# EasyEDA Pro project ProPrj_HydroNodeStation01_2026-04-23.epro, board PCB2
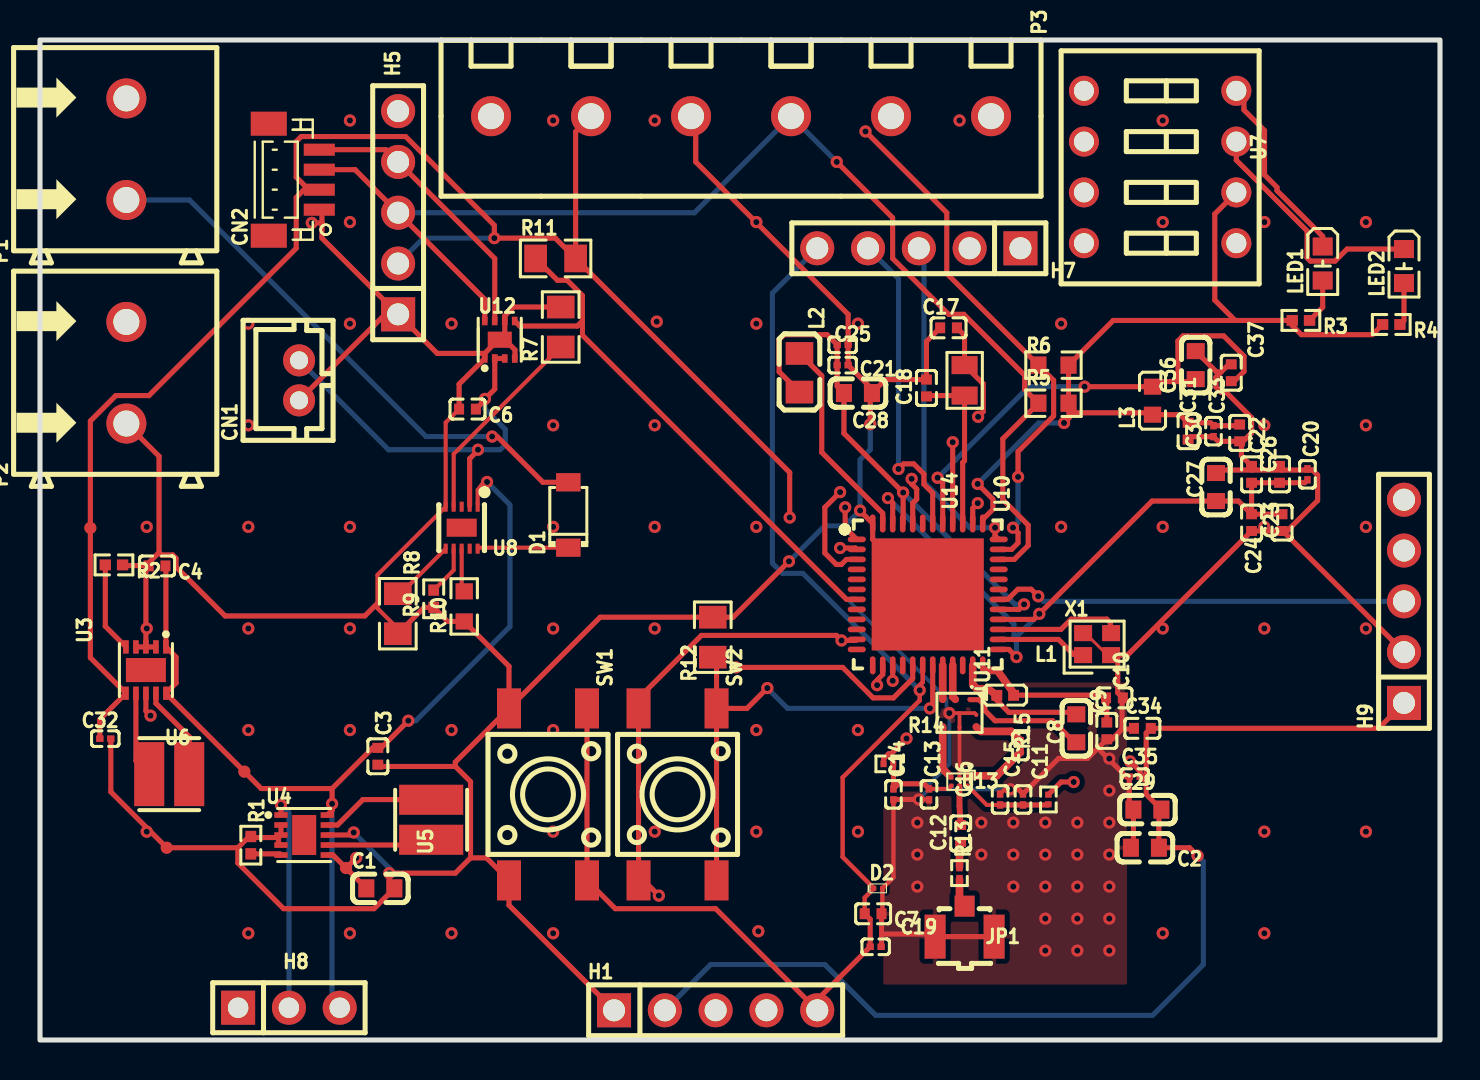
[diagram p2: board, top side]
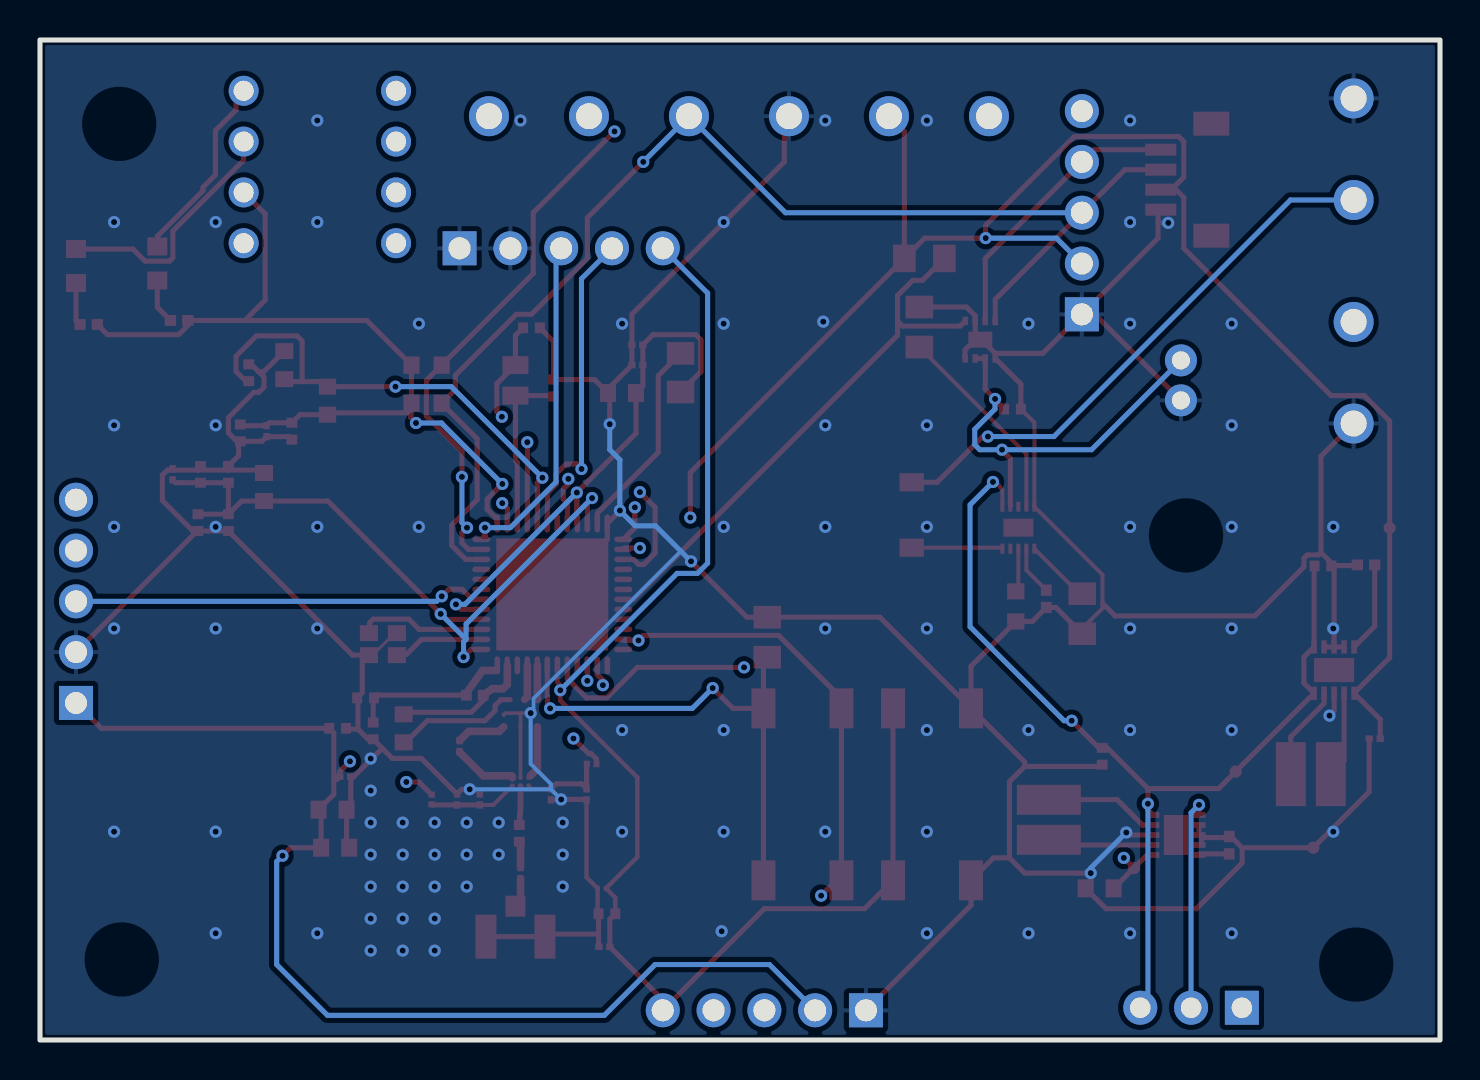
[diagram p3: board, bottom side, seen from below]

Outline 70 x 50 mm; copper layers: Top Layer, Inner1, Inner2, Bottom Layer. Coordinates in mm from the lower left corner of the outline.
Outline path: rectangle 0,50 70,0
Stack: Top Layer 0.035mm Outer layer thickness 1oz / Dielectric1 0.2104mm 7628 RC49% 8.6mil er 4.5 / Inner1 0.035mm Inner layer thickness / Dielectric2 1.065mm 1.1mm H/HOZ Copper / Inner2 0.035mm Inner layer thickness / Dielectric3 0.2104mm 7628 RC49% 8.6mil er 4.5 / Bottom Layer 0.035mm Outer layer thickness 1oz

## Design rules (mm)
template: JLCPCB Capability(Two Layers Board)
spacing copperThickness1oz (default): track to track 0.102, other pairs 0.152 to 0.3
spacing copperThickness2oz: track to track 0.203, other pairs 0.152 to 0.3
track width copperThickness1oz (default): min 0.127, default 0.254, max 2.54
track width copperThickness2oz: min 0.203, default 0.254, max 2.54
differential pair differentialPair (default): width min 0.127, default 0.254, max 2.54; gap min 0.152, default 0.152
via viaSize (default): diameter min 0.5, default 0.61, max 10; hole min 0.3, default 0.305, max 6.3
net GND uses copperThickness2oz
net +5V uses copperThickness2oz
net VCC uses copperThickness2oz
net LIPOPLUS uses copperThickness2oz
net SOLARPLUS uses copperThickness2oz

## Placement (name value [footprint] x y rotation side)
C1  22uF  [C0603]  17.02 7.58 0 top
C2  22uF  [C0603]  55.25 9.61 180 top
C3  10uF  [C0402]  16.89 14.19 270 top
C4  10uF  [C0402]  5.85 23.7 180 top
C6  100nF  [C0402]  21.38 31.55 180 top
C7  100nF  [C0402]  41.66 6.31 180 top
C8  100pF  [C0603]  51.82 15.58 90 top
C9  68pF  [C0402]  53.34 15.46 90 top
C10  47nF  [C0402]  53.72 17.11 180 top
C11  68pF  [C0201]  49.02 14.69 90 top
C12  68pF  [C0402]  46.03 10.33 90 top
C13  100nF  [C0201]  44.45 12.28 270 top
C14  1nF  [C0201]  42.67 12.28 270 top
C15  100nF  [C0201]  49.15 12.03 270 top
C16  1nF  [C0201]  48.01 12.03 270 top
C17  6.8pF  [C0402]  45.43 35.61 180 top
C18  6.8pF  [C0402]  44.32 32.6 90 top
C19  100nF  [C0201]  41.78 4.66 0 top
C20  33pF  [C0201]  63.37 28.28 270 top
C21  33pF  [C0201]  40.13 33.74 180 top
C22  100nF  [C0402]  60.58 28.28 270 top
C23  100nF  [C0402]  62.1 25.87 90 top
C24  100nF  [C0402]  60.58 25.87 90 top
C25  33pF  [C0201]  40.13 34.76 0 top
C26  100nF  [C0402]  61.98 28.28 90 top
C27  4.7uF  [C0603]  58.8 27.65 90 top
C28  470nF  [C0603]  40.9 32.35 0 top
C29  4.7uF  [C0603]  55.37 11.52 0 top
C30  100nF  [C0402]  57.4 30.44 270 top
C31  100nF  [C0402]  59.98 30.35 270 top
C32  100nF  [C0201]  3.26 15.07 0 top
C33  100nF  [C0201]  58.67 30.44 270 top
C34  100nF  [C0402]  55.12 15.58 0 top
C35  100nF  [C0201]  54.74 13.17 0 top
C36  4.7uF  [C0603]  57.79 33.74 90 top
C37  100nF  [C0402]  59.56 33.36 90 top
CN1  B2B-PH-K-S(LF)(SN)  [CONN-TH_B2B-PH-K-S]  12.95 32.98 90 top
CN2  BM04B-SRSS-TB(LF)(SN)  [CONN-SMD_BM04B-SRSS-TB]  12.7 43.02 90 top
D1  MBRX120LF-TP  [SOD-123_L2.7-W1.6-LS3.7-RD]  26.42 26.25 90 top
D2  ESDALC6V1-1U2  [DFN0603-D_L0.6-W0.3-P0.34-RD]  41.91 7.58 0 top
H1  PZ254V-11-05P  [HDR-TH_5P-P2.54-V-M]  33.78 1.49 0 top
H5  PZ254V-11-05P  [HDR-TH_5P-P2.54-V-M]  17.91 41.36 90 top
H7  PZ254V-11-05P  [HDR-TH_5P-P2.54-V-M]  43.94 39.59 180 top
H8  PZ254V-11-03P  [HDR-TH_3P-P2.54-V-M_PZ254V-11-03P]  12.45 1.61 0 top
H9  PZ254V-11-05P  [HDR-TH_5P-P2.54-V-M]  68.2 21.93 90 top
JP1  6GHz  [RF-SMD_FRF05002-JSS103M]  46.23 5.93 180 top
L1  47nH  [L0402]  48.26 17.23 180 top
L2  15uH  [L0805]  37.97 33.36 270 top
L3  FCM1608KF-601T03  [L0603]  55.63 31.97 90 top
LED1  YLED0603R  [LED0603-FD]  64.14 38.82 90 top
LED2  YLED0603R  [LED0603-FD]  68.2 38.7 90 top
NOREF  -  [Pad_e306342]  10.22 13.42 0 top
NOREF#2  -  [Pad_e306341]  6.34 9.61 0 top
NOREF#3  -  [Pad_e306354]  15.3 8.6 0 top
NOREF#4  -  [Pad_e306348]  2.52 25.6 0 top
P1  WJ500V-5.08-2P  [CONN-TH_2P-P5.00_WJ500V-5.08-2P]  4.32 44.54 90 top
P2  WJ500V-5.08-2P  [CONN-TH_2P-P5.00_WJ500V-5.08-2P]  4.32 33.36 90 top
P3  WJ126V-5.0-6P  [CONN-TH_6P-P5.00_WJ126V-5.0-6P]  35.05 46.19 270 top
R1  36.5kΩ  [R0402]  10.54 9.74 270 top
R2  16.2kΩ  [R0402]  3.7 23.76 180 top
R3  1kΩ  [R0402]  63.04 35.98 180 top
R4  1kΩ  [R0402]  67.56 35.78 180 top
R5  4.7kΩ  [R0603]  50.67 31.84 0 top
R6  4.7kΩ  [R0603]  50.67 33.74 0 top
R7  10kΩ  [R0805]  26.04 35.65 90 top
R8  10kΩ  [R0805]  17.89 21.31 270 top
R9  12kΩ  [R0402]  19.69 22.06 90 top
R10  300Ω  [R0603]  21.21 21.68 90 top
R11  10kΩ  [R0805]  25.78 39.08 0 top
R12  10kΩ  [R0805]  33.64 20.14 90 top
R13  0Ω  [R0201]  45.97 8.34 270 top
R14  100Ω  [R0201]  42.42 13.81 180 top
R15  100Ω  [R0201]  50.42 12.03 270 top
SW1  TS-1095PS-A1B2-C3D2  [KEY-SMD_4P-L6.0-W6.0-P3.90-LS9.0]  25.4 12.28 270 top
SW2  TS-1095PS-A1B2-C3D2  [KEY-SMD_4P-L6.0-W6.0-P3.90-LS9.0]  31.88 12.28 270 top
U3  TPS63900DSKR  [WSON-10_L2.5-W2.5-W0.50-TL-EP]  5.3 18.5 270 top
U4  TPS63900DSKR  [WSON-10_L2.5-W2.5-W0.50-TL-EP]  13.21 10.25 0 top
U5  2.2uH  [IND-SMD_L3.0-W3.0_LVF303012-4R7M-N]  19.56 11.01 90 top
U6  2.2uH  [IND-SMD_L3.0-W3.0_LVF303012-4R7M-N]  6.46 13.29 0 top
U7  SMQS-04R-TP  [SW-TH_8P-P2.54_SMQS-04R-TP]  56.01 43.65 270 top
U8  BQ25185DLHR  [WSON-10_L2.2-W2.0-P0.40-BL-EP_TI_DLH0010A]  21.08 25.62 180 top
U10  STM32WLE5CCU6  [UFQFPN-48_L7.0-W7.0-P0.50-BL-EP5.6]  44.39 22.28 270 top
U11  BALFHB-WL-02D3  [CSPG-8_L2.1-W1.8_BALFHB-WL-03D3]  45.97 16.35 270 top
U12  MAX17048G+T10  [TDFN-8_L2.0-W2.0-P0.50-BL-EP1.2]  22.99 35.01 0 top
U13  BGS12SN6E6327XTSA1  [TSNP-6_L1.1-W0.7-P0.40-BL]  45.97 12.92 180 top
U14  32.768kHz  [CRYSTAL-SMD_L2.0-W1.2]  46.23 32.98 90 top
X1  32MHz  [CRYSTAL-SMD_4P-L2.0-W1.6-BL]  52.86 19.79 0 top

## Footprints (pads in the part's own frame, mm; a bottom-side part is the same pattern mirrored in y, then rotated)
C0201
  rect 0.368x0.324 smd: 1(-0.275,0) 2(0.275,0)
C0402
  rect 0.5x0.54 smd: 1(-0.42,0) 2(0.42,0)
C0603
  rect 0.8x0.9 smd: 1(-0.7,0) 2(0.7,0)
CONN-SMD_BM04B-SRSS-TB
  rect 1.2x1.8 smd: 0(-2.8,1.262) 0(2.8,1.262)
  rect 0.6x1.55 smd: 1(-1.5,-1.262) 2(-0.5,-1.262) 3(0.5,-1.262) 4(1.5,-1.262)
CONN-TH_2P-P5.00_WJ500V-5.08-2P
  round 2 hole 1.3: 1(-2.54,0) 2(2.54,0)
CONN-TH_6P-P5.00_WJ126V-5.0-6P
  round 2 hole 1.3: 1(0,12.501) 2(0,7.5) 3(0,2.501) 4(0,-2.501) 5(0,-7.5) 6(0,-12.501)
CONN-TH_B2B-PH-K-S
  round 1.6 hole 0.9: 1(1,0) 2(-1,0)
CRYSTAL-SMD_4P-L2.0-W1.6-BL
  rect 0.9x0.8 smd: 1(-0.7,-0.55) 2(0.7,-0.55) 3(0.7,0.55) 4(-0.7,0.55)
CRYSTAL-SMD_L2.0-W1.2
  rect 0.9x1.3 smd: 1(-0.762,0) 2(0.762,0)
CSPG-8_L2.1-W1.8_BALFHB-WL-03D3
  round 0.204 smd: A1(-0.69,0.5) A2(-0.69,-0.21) A3(-0.69,-0.84) B1(0.085,0.84) B2(0,0) C1(0.69,0.84) C2(0.69,0) C3(0.69,-0.84)
DFN0603-D_L0.6-W0.3-P0.34-RD
  rect 0.22x0.26 smd: 1(-0.21,0) 2(0.21,0)
HDR-TH_3P-P2.54-V-M_PZ254V-11-03P
  rect 1.7x1.7 hole 1.02: 1(-2.54,0)
  round 1.7 hole 1.02: 2(0,0) 3(2.54,0)
HDR-TH_5P-P2.54-V-M
  rect 1.7x1.7 hole 1.1: 1(-5.08,0)
  round 1.7 hole 1.1: 2(-2.54,0) 3(0,0) 4(2.54,0) 5(5.08,0)
IND-SMD_L3.0-W3.0_LVF303012-4R7M-N
  rect 1.5x3.2 smd: 1(-1,0) 2(1,0)
KEY-SMD_4P-L6.0-W6.0-P3.90-LS9.0
  rect 2x1.2 smd: 1(-4.3,1.95) 2(4.3,1.95) 3(-4.3,-1.95) 4(4.3,-1.95)
L0402
  rect 0.54x0.54 smd: 1(-0.42,0) 2(0.42,0)
L0603
  rect 0.8x0.864 smd: 1(-0.7,0) 2(0.7,0)
L0805
  rect 1.133x1.377 smd: 1(-0.966,0) 2(0.966,0)
LED0603-FD
  rect 0.9x1 smd: 1(-0.85,0) 2(0.85,0)
Pad_e306341
  round 0.61 smd: TP1(0,0)
Pad_e306342
  round 0.61 smd: TP2(0,0)
Pad_e306348
  round 0.61 smd: TP3(0,0)
Pad_e306354
  round 0.61 smd: TP4(0,0)
R0201
  rect 0.303x0.324 smd: 1(-0.241,0) 2(0.241,0)
R0402
  rect 0.566x0.54 smd: 1(-0.433,0) 2(0.433,0)
R0603
  rect 0.806x0.864 smd: 1(-0.753,0) 2(0.753,0)
R0805
  rect 1.133x1.377 smd: 1(-1,0) 2(1,0)
RF-SMD_FRF05002-JSS103M
  rect 1x1.05 smd: 1(0,-0.762)
  rect 1.05x2.2 smd: 2(-1.475,0.762) 3(1.475,0.762)
SOD-123_L2.7-W1.6-LS3.7-RD
  rect 0.91x1.22 smd: 1(-1.635,0) 2(1.635,0)
SW-TH_8P-P2.54_SMQS-04R-TP
  round 1.5 hole 1: 1(-3.81,-3.81) 2(-1.27,-3.81) 3(1.27,-3.81) 4(3.81,-3.81) 5(3.81,3.81) 6(1.27,3.81) 7(-1.27,3.81) 8(-3.81,3.81)
TDFN-8_L2.0-W2.0-P0.50-BL-EP1.2
  rect 0.28x0.425 smd: 1(-0.75,-0.938) 2(-0.25,-0.938) 3(0.25,-0.938) 4(0.75,-0.938) 5(0.75,0.938) 6(0.25,0.938) 7(-0.25,0.938) 8(-0.75,0.938)
  rect 1.2x0.8 smd: 9(0,0)
TSNP-6_L1.1-W0.7-P0.40-BL
  rect 0.2x0.2 smd: 1(-0.4,-0.2) 2(0,-0.2) 3(0.4,-0.2) 4(0.4,0.2) 5(0,0.2) 6(-0.4,0.2)
UFQFPN-48_L7.0-W7.0-P0.50-BL-EP5.6
  oval 0.28x0.9 smd: 1(-2.751,-3.547) 2(-2.251,-3.547) 3(-1.75,-3.547) 4(-1.25,-3.547) 5(-0.75,-3.547) 6(-0.249,-3.547) 7(0.249,-3.547) 8(0.75,-3.547) 9(1.25,-3.547) 10(1.75,-3.547) 11(2.251,-3.547) 12(2.751,-3.547) 25(2.751,3.547) 26(2.251,3.547) 27(1.75,3.547) 28(1.25,3.547) 29(0.75,3.547) 30(0.249,3.547) 31(-0.249,3.547) 32(-0.75,3.547) 33(-1.25,3.547) 34(-1.75,3.547) 35(-2.251,3.547) 36(-2.751,3.547)
  oval 0.9x0.28 smd: 13(3.547,-2.75) 14(3.547,-2.25) 15(3.547,-1.75) 16(3.547,-1.25) 17(3.547,-0.75) 18(3.547,-0.25) 19(3.547,0.25) 20(3.547,0.75) 21(3.547,1.25) 22(3.547,1.75) 23(3.547,2.25) 24(3.547,2.75) 37(-3.547,2.751) 38(-3.547,2.251) 39(-3.547,1.75) 40(-3.547,1.25) 41(-3.547,0.75) 42(-3.547,0.249) 43(-3.547,-0.249) 44(-3.547,-0.75) 45(-3.547,-1.25) 46(-3.547,-1.75) 47(-3.547,-2.251) 48(-3.547,-2.751)
  rect 5.6x5.6 smd: 49(0,0)
WSON-10_L2.2-W2.0-P0.40-BL-EP_TI_DLH0010A
  rect 0.2x0.5 smd: 1(-0.8,-1.05) 2(-0.4,-1.05) 3(0,-1.05) 4(0.4,-1.05) 5(0.8,-1.05) 6(0.8,1.05) 7(0.4,1.05) 8(0,1.05) 9(-0.4,1.05) 10(-0.8,1.05)
  rect 1.5x0.9 smd: 11(0,0)
WSON-10_L2.5-W2.5-W0.50-TL-EP
  rect 0.665x0.28 smd: 1(-1.157,1) 2(-1.157,0.5) 3(-1.157,0) 4(-1.157,-0.5) 5(-1.157,-1) 6(1.157,-1) 7(1.157,-0.5) 8(1.157,0) 9(1.157,0.5) 10(1.157,1)
  rect 1.2x2 smd: 11(0,0)

## Nets
As in the schematic, except:
+5V: C1.1 H5.5 NOREF#3.TP4 P3.6 U4.6
GND: C1.2 C2.2 C3.2 C4.2 C6.2 C7.1 C9.1 C10.1 C13.2 C14.2 C15.1 C16.1 C17.2 C18.2 C19.2 C20.1 C21.1 C22.1 C23.1 C24.1 C25.2 C26.2 C27.2 C28.2 C29.1 C30.2 C31.2 C32.2 C33.2 C34.1 C35.1 C36.2 C37.2 CN1.2 CN2.1 D2.2 H1.1 H5.1 H7.1 H7.2 H9.2 JP1.2 JP1.3 NOREF#2.TP1 P1.2 P2.1 P3.4 R1.1 R2.1 R7.2 R8.2 R9.1 R10.1 R12.2 SW1.3 SW1.4 U3.2 U3.3 U3.4 U3.8 U4.2 U4.3 U4.4 U4.8 U8.5 U10.48 U10.49 U11.B1 U11.B2 U11.C2 U12.1 U12.4 U12.6 U12.9 U13.2 X1.2 X1.4
VCC: C2.1 C29.2 C30.1 C31.1 C32.1 C33.1 C34.2 C35.2 CN2.2 H1.2 H5.2 H9.1 L3.1 NOREF#4.TP3 P3.5 R3.2 R4.2 R5.2 R6.2 R11.2 R14.2 SW2.3 SW2.4 U3.6 U7.6 U10.11 U10.37 U10.44
LIPOPLUS: C3.1 C4.1 H8.3 NOREF.TP2 U3.1 U3.10 U4.10 U8.1

Pads without a net: CN2 0; H9 4 5; U3 11; U4 11; U7 4 5; U8 3 9 11; U10 5 6 8 9 10 12 13 16 22 31 32 33 43

## Via types
v1: diameter 0.61, hole 0.305, Top Layer to Bottom Layer, 140 vias

## Routing (per net, layer and track width the routed paths; a pad name or vN(x,y) marks a point on that pad's centre or on a via; arc(x,y) is an arc through that point)
+5V: length 46.2
  Top Layer w0.254: NOREF#3.TP4 v1(15.81,9.11) ; NOREF#3.TP4 14.65,9.25 U4.6 ; NOREF#3.TP4 C1.1
  Inner2 w0.254: v1(15.81,9.11) 16.64,9.93 16.64,44.48 17.91,45.75 17.91,46.26 ; 17.91,46.26 22.49,46.26 P3.6 ; 17.91,46.26 H5.5
GND: length 331.3
  Top Layer w0.14: 52.43,20.18 53.22,19.39 53.34,19.39
  Top Layer w0.184: U11.B1 46.73,16.35 U11.B2 ; U11.B2 U11.C2 U13.2 ; U11.B2 v1(45.47,16.35)
  Top Layer w0.2: R8.2 17.89,20.57 16.88,21.58 16.88,23.26 U8.5 20.28,30.87 20.95,31.55 ; v1(43.94,12.03) 44.43,12.03 C13.2 ; v1(48.51,12.54) 48.24,12.54 C16.1
  Top Layer w0.22: C14.2 42.67,8.13 D2.2 42.12,6.36 C7.1
  Top Layer w0.254: SW1.3 28.01,21.14 R12.2 34.66,21.14 v1(37.45,23.93) ; SW1.3 20.77,13.9 20.77,13.68 ; SW1.3 23.45,18.68 R10.1 20.39,20.93 R9.1 19.2,21.63 R8.2 ; 10.65,10.12 10.4,10.12 9.89,9.61 ; 10.65,10.12 11.92,10.12 ; 10.65,10.12 10.54,10.17 ; 5.3,23.72 U3.3 ; 5.3,23.72 C4.2 ; 5.3,23.72 5.95,24.38 ; 5.3,23.72 4.16,23.72 R2.1 ; U3.3 U3.4 ; U3.3 U3.2 ; 17.65,36.54 14.1,40.09 14.1,40.86 ; 17.65,36.54 H5.1 19.86,34.33 22.24,34.33 ; 17.65,36.54 17.51,36.54 CN1.2 ; v1(48.51,12.54) 48.92,12.54 C15.1 50.93,14.08 52.38,14.08 52.89,14.59 ; 9.89,9.61 NOREF.TP1 3.54,12.41 3.54,15.06 ; 9.89,9.61 9.89,8.85 12.18,6.57 16.7,6.57 C1.2 17.46,7.84 v1(17.46,8.34) 20.77,8.34 21.53,9.11 ; 60.58,28.5 C22.1 60.07,29.21 60.07,29.85 ; 60.58,28.5 58.95,28.5 C27.2 ; 60.58,28.5 62.1,28.5 ; 11.92,10.12 11.92,9.88 U4.4 ; 11.92,10.12 U4.3 U4.2 ; 54.1,15.54 53.59,15.04 C9.1 52.89,14.59 ; 54.1,15.54 54.66,15.54 C34.1 ; 54.1,15.54 54.1,17.07 C10.1 53.89,17.36 53.89,19.24 ; U10.49 41.64,25.03 U10.48 41.01,26.46 v1(41.01,26.47) ; 20.77,13.68 16.98,13.68 C3.2 ; 20.77,13.68 21.53,12.92 21.53,9.11 ; v1(15.69,10.38) 15.56,10.25 U4.8 ; 20.95,31.55 20.95,32.79 U12.1 22.24,34.33 ; 59.05,33.4 59.44,33.78 C37.2 ; 59.05,33.4 58.8,33.15 58.8,32.64 59.05,32.39 59.31,32.39 60.58,31.12 60.58,30.35 60.07,29.85 ; 59.05,33.4 58.83,33.4 C36.2 ; U12.9 23.24,35.26 U12.6 23.24,36.21 23.68,36.65 R7.2 ; U12.9 22.92,35.01 22.24,34.33 ; U12.9 23.24,35.01 23.75,34.51 23.75,34.09 U12.4 ; 53.89,19.24 X1.2 ; 53.89,19.24 54.37,19.24 C24.1 C23.1 62.14,25.45 ; 60.07,29.85 C31.2 58.91,29.93 C33.2 57.55,30.17 C30.2 ; 52.89,14.59 54.31,13.17 C35.1 54.46,11.73 C29.1 54.67,9.74 C2.2 ; C28.2 42.27,33.02 C18.2 44.32,34.93 C17.2 ; C28.2 41.6,32.55 C21.1 C25.2 40.41,36.28 32.79,43.9 32.79,45.96 P3.4 ; C28.2 41.51,32.26 v1(41.51,30.79) ; 5.95,24.38 6.08,24.25 6.64,24.25 6.8,24.09 6.8,23.66 9.26,21.2 16.24,21.2 16.88,21.84 ; 5.95,24.38 5.95,29.19 P2.1 ; 62.14,25.45 H9.2 ; 62.14,25.45 62.36,25.45 63.88,26.97 63.88,28.24 63.63,28.5 62.1,28.5 ; C7.1 42.08,5.3 ; 42.08,5.3 44.63,5.3 JP1.3 JP1.2 ; 42.08,5.3 42.08,4.68 C19.2 ; U3.8 5.3,16.45 v1(5.53,16.22) ; 21.53,9.11 22.33,9.11 SW1.4 23.45,6.74 H1.1 ; 14.1,40.86 14.1,41.38 CN2.1 ; 14.1,40.86 v1(13.59,40.86) ; 62.1,28.5 C26.2 ; C14.2 42.69,12.03 v1(43.94,12.03)
  Inner2 w0.254: v1(15.69,10.38) 11.37,10.38 v1(5.53,16.22) ; v1(13.59,40.86) 10.54,40.86 P1.2 ; v1(41.51,30.79) 46.48,35.76 H7.2 H7.1
  Bottom Layer w0.184: 37.96,24.44 45.32,17.08 45.32,16.49 v1(45.47,16.35)
  Bottom Layer w0.2: 44.45,12.54 v1(48.51,12.54) ; 44.45,12.54 44.45,12.79 45.47,13.81 v1(45.47,16.35) ; 44.45,12.54 v1(43.94,12.03)
  Bottom Layer w0.254: v1(37.45,23.93) 39.23,25.71 40.24,25.71 v1(41.01,26.47) 41.01,29.01 41.51,29.52 v1(41.51,30.79) ; v1(15.69,10.38) 17.46,8.6 v1(17.46,8.34)
  vias: v1(5.34,25.66) v1(5.34,20.58) v1(5.34,10.42) v1(10.42,35.82) v1(10.42,30.74) v1(10.42,25.66) v1(10.42,20.58) v1(10.42,15.5) v1(10.42,5.34) v1(15.5,45.98) v1(15.5,40.9) v1(15.5,35.82) v1(15.5,25.66) v1(15.5,20.58) v1(15.5,15.5) v1(15.5,5.34) v1(20.58,35.82) v1(20.58,15.5) v1(20.58,5.34) v1(25.66,45.98) v1(25.66,30.74) v1(25.66,25.66) v1(25.66,20.58) v1(25.66,15.5) v1(25.66,10.42) v1(25.66,5.34) v1(30.74,45.98) v1(30.74,30.74) v1(30.74,25.66) v1(30.74,20.58) v1(30.74,10.42) v1(30.84,35.92) v1(35.82,40.9) v1(35.82,35.82) v1(35.82,25.66) v1(35.82,15.5) v1(35.82,10.42) v1(35.92,5.44) v1(40.9,35.82) v1(40.9,15.5) v1(40.9,10.42) v1(43.87,10.87) v1(43.87,9.27) v1(43.87,7.67) v1(45.98,45.98) v1(47.07,10.87) v1(47.07,9.27) v1(48.67,10.87) v1(48.67,9.27) v1(48.67,7.67) v1(50.27,10.87) v1(50.27,9.27) v1(50.27,7.67) v1(50.27,6.07) v1(50.27,4.47) v1(51.06,35.82) v1(51.06,25.66) v1(51.87,10.87) v1(51.87,9.27) v1(51.87,7.67) v1(51.87,6.07) v1(51.87,4.47) v1(53.47,14.07) v1(53.47,12.47) v1(53.47,10.87) v1(53.47,9.27) v1(53.47,7.67) v1(53.47,6.07) v1(53.47,4.47) v1(56.14,45.98) v1(56.14,40.9) v1(56.14,25.66) v1(56.14,20.58) v1(56.14,5.34) v1(61.22,40.9) v1(61.22,30.74) v1(61.22,25.66) v1(61.22,20.58) v1(61.22,10.42) v1(61.22,5.34) v1(66.3,40.9) v1(66.3,30.74) v1(66.3,25.66) v1(66.3,20.58) v1(66.3,10.42)
VCC: length 209.8
  Top Layer w0.254: R11.2 37.49,28.37 v1(37.49,26.12) ; R11.2 26.78,45.42 P3.5 ; R11.2 25.77,40.09 v1(22.72,40.09) 22.72,40.74 18.28,45.17 13.07,45.17 12.81,44.92 12.81,43.14 13.32,42.63 ; U10.44 43.64,26.84 43.84,27.04 43.84,27.55 43.58,27.8 v1(43.58,28.06) ; 13.32,42.63 13.84,42.63 CN2.2 ; 13.32,42.63 12.81,42.13 12.81,39.59 5.45,32.22 3.79,32.22 2.52,30.95 NOREF#4.TP3 2.52,19.12 U3.6 2.99,16.03 C32.1 ; v1(30.94,7.22) 30.18,7.98 SW2.4 SW2.3 29.93,17.09 33.07,20.23 39.82,20.23 v1(40.08,19.98) 40.79,19.98 U10.11 ; 55.31,13.04 55.14,13.04 C35.2 55.01,13.42 v1(54.5,13.93) ; 55.31,13.04 55.31,15.36 C34.2 66.93,15.58 H9.1 ; 55.31,13.04 55.31,12.28 C29.2 55.95,11.39 C2.1 ; 51.46,31.36 55.53,31.36 L3.1 57,31.27 C30.1 58.53,30.86 C33.1 59.92,30.72 C31.1 ; 51.46,31.36 51.46,31.81 R5.2 R6.2 53.66,35.98 59.76,35.98 ; 51.46,31.36 51.46,31.11 v1(51.2,30.85) ; v1(46.88,27.8) 47.65,27.04 47.65,26.53 47.14,26.02 U10.37 ; R4.2 66.62,35.27 63.07,35.27 62.61,35.72 R3.2 59.76,35.98 ; v1(43.33,15.08) 42.57,14.31 42.44,14.31 42.18,14.05 R14.2 ; 59.76,35.98 58.74,36.99 58.74,41.3 U7.6
  Inner2 w0.254: v1(46.88,27.8) 46.12,27.04 43.84,27.04 ; 43.58,24.09 43.33,23.84 39.77,23.84 v1(37.49,26.12) ; 43.58,24.09 43.58,22.82 41.8,21.04 41.8,19.77 ; 43.58,24.09 43.58,26.79 43.84,27.04 ; v1(43.58,28.06) 43.84,27.8 43.84,27.04 ; 41.8,19.77 41.04,19.77 40.84,19.98 v1(40.08,19.98) ; 41.8,19.77 43.33,18.25 v1(43.33,15.08) ; v1(30.94,7.22) 30.94,1.79 H1.2
  Bottom Layer w0.254: v1(22.72,40.09) 19.18,40.09 H5.2 ; v1(46.88,27.8) 49.93,30.85 v1(51.2,30.85)
  vias: v1(57.88,9.21)
VDDA: length 24.8
  Top Layer w0.254: v1(52.23,32.67) L3.2 55.88,32.92 56.9,32.92 ; 56.9,32.92 56.9,34.95 57.15,35.21 59.18,35.21 60.2,34.19 60.2,33.43 59.71,32.94 C37.1 ; 56.9,32.92 57.66,32.92 C36.1 ; U10.41 45.14,27.86 v1(44.88,28.11)
  Bottom Layer w0.254: v1(44.88,28.11) 49.43,32.67 v1(52.23,32.67)
VDDPA: length 36.1
  Top Layer w0.254: C24.2 C22.2 C26.1 63.23,27.86 C20.2 ; C24.2 59.92,26.95 C27.1 55.61,26.95 v1(49.97,21.31) 49.69,21.03 U10.28 ; C24.2 C23.2 ; v1(48.82,19.15) 48.44,19.53 47.93,19.53 ; v1(42.4,27.1) 42.64,26.86 U10.46
  Bottom Layer w0.254: 48.7,20.04 48.7,20.8 v1(42.4,27.1) ; 48.7,20.04 48.82,19.91 v1(48.82,19.15) ; 48.7,20.04 v1(49.97,21.31)
VDDRF1V55: length 26.3
  Top Layer w0.254: U10.29 48.95,21.53 v1(49.2,21.78) ; U10.45 43.16,25.85 v1(43.16,27.37) 40.2,30.33 C28.1 39.86,32.69 C21.2 C25.1 39.35,35.27 37.21,35.27 36.96,35.01 36.96,33.41 L2.2
  Bottom Layer w0.254: v1(43.16,27.37) 48.75,21.78 v1(49.2,21.78)
BOOT: length 25
  Top Layer w0.254: R12.1 33.83,18.95 SW2.1 ; SW2.1 35.35,16.58 v1(36.37,17.6) ; SW2.1 SW2.2 ; 44.64,18.73 44.64,16.72 v1(44.5,16.58)
  Bottom Layer w0.254: v1(36.37,17.6) 37.38,16.58 v1(44.5,16.58)
CLK: length 15.9
  Top Layer w0.254: U10.42 44.64,27.35 44.2,27.79 44.2,28.3 43.69,28.81 43.18,28.81 v1(42.93,28.55)
  Bottom Layer w0.254: H7.4 42.93,38.06 v1(42.93,28.55)
DIO: length 17
  Top Layer w0.254: v1(47.75,25.62) 47.75,25.21 U10.36
  Bottom Layer w0.254: v1(47.75,25.62) 46.48,25.62 44.2,27.9 44.2,39.33 H7.3
EN5V: length 42.5
  Top Layer w0.254: v1(34.8,18.63) 40.13,18.63 41.66,17.11 42.67,17.11 43.64,18.07 43.64,18.73
  Inner2 w0.254: H8.1 26.92,18.63 v1(34.8,18.63)
LED1: length 9.6
  Top Layer w0.254: LED1.2 64.14,40.18 61.85,42.47 61.85,42.63 61.23,43.26 61.23,45.47 60.2,46.5 60.2,47.08 U7.8
LED2: length 12.4
  Top Layer w0.254: LED2.2 65.35,39.55 64.75,38.95 63.52,38.95 63.36,39.11 63.36,40.45 59.82,43.99 U7.7
LIPOPLUS: length 32
  Top Layer w0.254: U4.10 14.61,11.49 v1(14.61,11.81) 14.61,12.57 ; C4.1 6.3,23.68 U3.1 6.8,19.15 6.8,17.85 U3.10 NOREF.TP2 11.06,12.57 14.61,12.57 ; 14.61,12.57 16.64,14.61 C3.1
  Bottom Layer w0.254: v1(14.61,11.81) 14.61,1.99 H8.3
  vias: v1(18.42,15.96) v1(22.35,27.9)
PA0: length 27.9
  Top Layer w0.254: 27.12,35.95 27.12,35.24 40.33,22.03 U10.7 ; 27.12,35.95 26.87,35.7 23.99,35.7 U12.5 ; 27.12,35.95 27.12,37.22 26.36,37.98 25.88,37.98 R11.1
PB0: length 20.7
  Top Layer w0.254: v1(49.91,22.19) 49.56,22.54 48.89,22.54 48.39,22.03 U10.30
  Bottom Layer w0.254: v1(49.91,22.19) 50.17,21.93 H9.3
PB3: length 25.1
  Top Layer w0.254: v1(40.26,26.63) 40.26,25.61 U10.1
  Inner2 w0.254: U7.2 50.17,42.89 50.17,38.57 41.02,29.43 41.02,27.39 v1(40.26,26.63)
PB4: length 23.7
  Top Layer w0.254: v1(40.01,24.6) 40.77,24.6 U10.2
  Inner2 w0.254: v1(40.01,24.6) 41.78,26.38 41.78,29.43 50.67,38.32 50.67,40.86 U7.3
PB5: length 30.4
  Top Layer w0.254: U10.3 40.32,24.03 40.07,23.78 39.81,23.78 39.24,24.35 39.24,26.63 v1(40.01,27.39)
  Inner2 w0.254: v1(40.01,27.39) 40.01,30.19 45.08,35.27 45.08,40.35 U7.1
PC13: length 19.5
  Top Layer w0.254: v1(51.69,12.9) 51.05,12.9 R15.1 ; U10.38 46.64,26.59 v1(46.89,26.84)
  Inner2 w0.254: v1(51.69,12.9) 50.55,14.04 50.55,24.83 48.54,26.84 v1(46.89,26.84)
RST: length 70.4
  Top Layer w0.22: C7.2 41.24,7.12 D2.1 40.13,9.15 40.13,13.13 43.99,16.98 43.99,17.74 44.14,17.89 44.14,18.73
  Top Layer w0.254: C7.2 41.51,6.04 C19.1 38.86,2.01 H1.5 33.78,6.57 28.77,6.57 SW1.2 SW1.1
  Bottom Layer w0.254: H7.5 36.62,37.34 36.62,23.84 37.13,23.33 38.14,23.33 v1(43.99,17.49)
RX: length 19.9
  Top Layer w0.254: v1(42.64,17.96) 42.64,18.73
  Inner2 w0.254: v1(42.64,17.96) 42.64,7.8 H1.4
SCL: length 68.4
  Top Layer w0.254: v1(48.65,25.62) 48.9,25.36 48.9,24.85 48.58,24.53 U10.35 ; U12.7 22.74,39.07 H5.4 17.3,44.52 CN2.4 ; v1(41.28,45.43) 45.34,41.36 45.34,38.32 R6.1 50.68,32.98 50.68,31.2 48.9,29.43 v1(48.9,28.16)
  Inner2 w0.254: 41.53,46.19 P3.2 ; 41.53,46.19 41.53,45.68 v1(41.28,45.43) ; 41.53,46.19 40.77,46.19 39.24,47.71 37.21,47.71 33.4,43.9 H5.4
  Bottom Layer w0.254: v1(48.9,28.16) 48.9,25.87 v1(48.65,25.62)
SDA: length 63.7
  Top Layer w0.254: CN2.3 15.76,43.52 H5.3 22.24,37.03 U12.8 ; v1(39.84,43.9) 42.63,41.11 42.63,39.08 45.43,36.28 46.19,36.28 49.24,33.24 49.24,32.52 R5.1 48.14,30.06 48.14,27.01 49.41,25.74 49.41,24.73 48.71,24.03 U10.34
  Bottom Layer w0.254: H5.3 32.73,41.36 P3.3 v1(39.84,43.9)
SOLARPLUS: length 59.5
  Top Layer w0.254: 26.42,27.89 25.15,27.89 22.86,30.17 v1(22.61,30.17)
  Inner2 w0.254: P3.1 46.01,44.65 37.08,44.65 v1(22.61,30.17)
  Bottom Layer w0.254: P1.1 7.48,42 19.3,30.17 v1(22.61,30.17)
TX: length 20.7
  Top Layer w0.254: v1(41.86,17.74) 41.86,18 42.14,18.28 42.14,18.73
  Inner2 w0.254: v1(41.86,17.74) 33.78,9.67 H1.3
$1N2497: length 4.3
  Top Layer w0.254: U6.1 4.8,13.96 U3.7
$1N2498: length 4.7
  Top Layer w0.254: U3.9 5.8,16.83 7.46,15.17 U6.2
$1N2499: length 5.7
  Top Layer w0.254: U4.9 14.87,10.75 16.14,12.02 19.55,12.02 U5.2
$1N2500: length 5.3
  Top Layer w0.254: U4.7 19.3,9.75 U5.1
$1N2509: length 4.5
  Top Layer w0.254: R2.2 3.26,20.69 U3.5
$1N2510: length 1.5
  Top Layer w0.254: U4.5 11.99,9.31 R1.2
$1N2511: length 10.8
  Top Layer w0.254: v1(12.05,11.76) U4.1
  Bottom Layer w0.254: v1(12.05,11.76) 12.45,11.36 H8.2
$1N2534: length 2.3
  Top Layer w0.254: LED1.1 64.14,36.64 R3.1
$1N2535: length 2.2
  Top Layer w0.254: R4.1 68.2,35.98 LED2.1
$1N2561: length 30.5
  Top Layer w0.254: 21.72,29.3 21.48,29.06 21.48,26.72 ; C6.1 22.25,32 v1(22.25,32.05) 22.74,32.54 U12.2 U12.3
  Inner2 w0.254: CN1.1 6.24,33.98 P2.2
  Bottom Layer w0.254: CN1.1 17.42,29.51 v1(21.9,29.51) 23.01,29.51 23.26,29.77 23.26,30.53 22.25,31.55 v1(22.25,32.05)
$1N2563: length 10.2
  Top Layer w0.2: R7.1 20.68,29.3 U8.4
$1N2564: length 4.6
  Top Layer w0.2: U8.10 21.93,24.62 D1.1
$1N2566: length 3.3
  Top Layer w0.2: U8.6 18.03,22.31 R8.1
$1N2567: length 2.5
  Top Layer w0.2: R9.2 20.68,23.49 U8.7
$1N2569: length 2.2
  Top Layer w0.2: U8.8 21.08,22.56 R10.2
$1N6744: length 4.4
  Top Layer w0.2: U13.4 45.41,12.56 C13.1
  Top Layer w0.254: C13.1 44.2,12.81 42.93,12.81 C14.1 42.67,13.79 R14.1
$1N7058: length 4.5
  Top Layer w0.2: C16.2 47.34,11.75 U13.6
  Top Layer w0.254: R15.2 50.39,11.75 C15.2 C16.2
$1N7626: length 11
  Top Layer w0.254: U10.40 v1(45.64,29.89) ; C17.1 46.23,35.23 U14.2 47.16,32.81 47.16,31.41 v1(46.91,31.16)
  Inner2 w0.254: v1(45.64,29.89) v1(46.91,31.16)
$1N7632: length 8.4
  Top Layer w0.254: U10.39 46.14,28.87 46.23,28.97 U14.1 44.36,32.22 C18.1
$1N11363: length 10.2
  Top Layer w0.254: U10.47 42.14,26.33 39.09,29.38 39.09,33.21 L2.1
$1N5916: length 1.8
  Top Layer w0.38: 45.64,18.73 45.64,17.16 U11.A2
$1N5921: length 1.7
  Top Layer w0.38: 45.13,18.73 U11.A3
$1N5997: length 6.4
  Top Layer w0.254: 46.51,17.02 46.95,17.02 47.24,16.73 47.24,16.47 47.75,15.96 50.64,15.96 51.82,14.78
$1N6001: length 6.8
  Top Layer w0.254: 47.71,17.23 47.71,17.11 48.44,16.38 51.69,16.38
  Top Layer w0.38: 46.64,18.73 46.64,17.77 46.84,17.56 47.38,17.56 L1.2
$1N6167: length 8.1
  Top Layer w0.254: 48.69,17.24 53.17,17.24 53.34,17.07 C9.2
  Top Layer w0.38: 47.19,18.48 47.87,18.48 48.76,17.23
$1N6399: length 2.5
  Top Layer w0.38: U11.C1 47.04,15.43 48.56,15.43 C11.2
$1N6407: length 3.2
  Top Layer w0.38: 46.38,13.11 46.38,13.16 46.43,13.21 47.84,13.21 49.02,14.39
$1N6414: length 2.6
  Top Layer w0.38: U11.C3 45.13,13.56 45.47,13.22
$1N6545: length 2
  Top Layer w0.29: 45.97,12.68 45.97,11.69 46.03,10.72
$1N6584: length 1.3
  Top Layer w0.38: 45.97,8.64 45.97,9.96
$1N6623: length 1.4
  Top Layer w0.38: 45.97,8.04 45.97,6.69
$1N7436: length 6.1
  Top Layer w0.254: 48.28,20.53 51.05,20.53 51.56,21.04 53.34,21.04 53.52,20.87 53.52,20.31
$1N7448: length 4.6
  Top Layer w0.254: U10.26 50.93,20.03 51.67,19.28 52.19,19.28

## Copper pours and planes (outline as drawn; the poured copper is in the pictures)
GND on Top Layer: 42.16,17.87 54.36,17.87 54.36,2.77 42.16,2.77
GND on Bottom Layer: -0.51,51.14 70.7,51.14 70.7,-0.54 -0.51,-0.54
GND on Inner1: 0.26,49.74 69.74,49.74 69.74,0.26 0.26,0.26

Small or netless copper shapes (teardrops, artwork), in the pictures only: 34 on Inner1
